# Altium schematic sheet Sheet1.SchDoc
size A; SheetNumber: 1; SheetTotal: 1
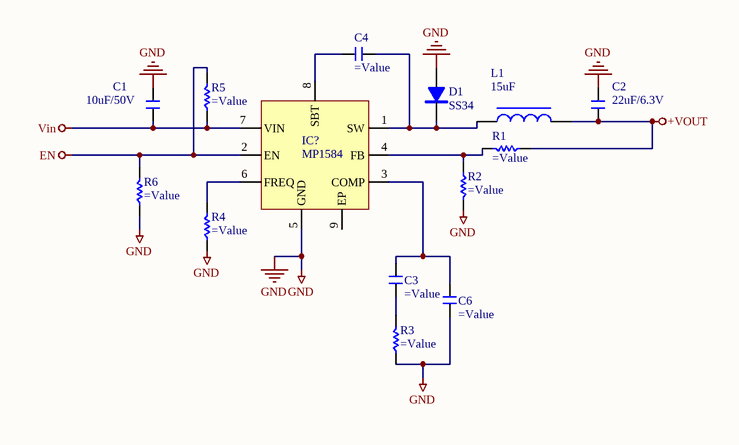
[diagram p0: Sheet1.SchDoc]

## Parts
C1  10uF/50V  [C 1206]
C2  22uF/6.3V  [C 1206]
C3  (no value)  [C 0402]
C4  (no value)  [C 0402]
C6  (no value)  [C 0402]
D1  SS34  [SMA]
IC?  MP1584  [SOP8_N-EP]
L1  15uF  [WHC0630]
R1  (no value)  [R 0402-HP]
R2  (no value)  [R 0402-HP]
R3  (no value)  [R 0402-HP]
R4  (no value)  [R 0402-HP]
R5  (no value)  [R 0402-HP]
R6  (no value)  [R 0402-HP]

## Nets
+VOUT: C2.1 L1.2 R1.1
EN: IC?.2(EN) R5.2 R6.2
GND: C1.2 C2.2 C6.1 D1.1(A) IC?.5(GND) R2.2 R3.1 R4.1 R6.1
Vin: C1.1 IC?.7(VIN) R5.1
NetC3_1: C3.1 R3.2
NetC3_2: C3.2 C6.2 IC?.3(COMP)
NetC4_1: C4.1 IC?.8(SBT)
NetC4_2: C4.2 D1.2(K) IC?.1(SW) L1.1
NetIC?_4: IC?.4(FB) R1.2 R2.1
NetIC?_6: IC?.6(FREQ) R4.2

Not connected (* = marked no-connect by the designer): IC? 9(EP)

## Library data of the parts
C1-C4 C6 = C: Non-polar patch capacitor; BOM名称: 无极性贴片电容; 版权归属: 源创客; 学习资源: www.ooocke.com
D1 = SS34: Schottky diodes; BOM名称: 肖特基二极管; 版权归属: 源创客; 属性: 40V/3A; 学习资源: www.ooocke.com
IC? = MP1584: DC step-down chip
L1 = L-WHC: One-piece high current inductor
R1-R6 = R: Chip resistor; 版权归属: 源创客; BOM名称: Chip resistor; 学习资源: www.ooocke.com